# EAGLE schematic Shutter (EAGLE 8.2.2)
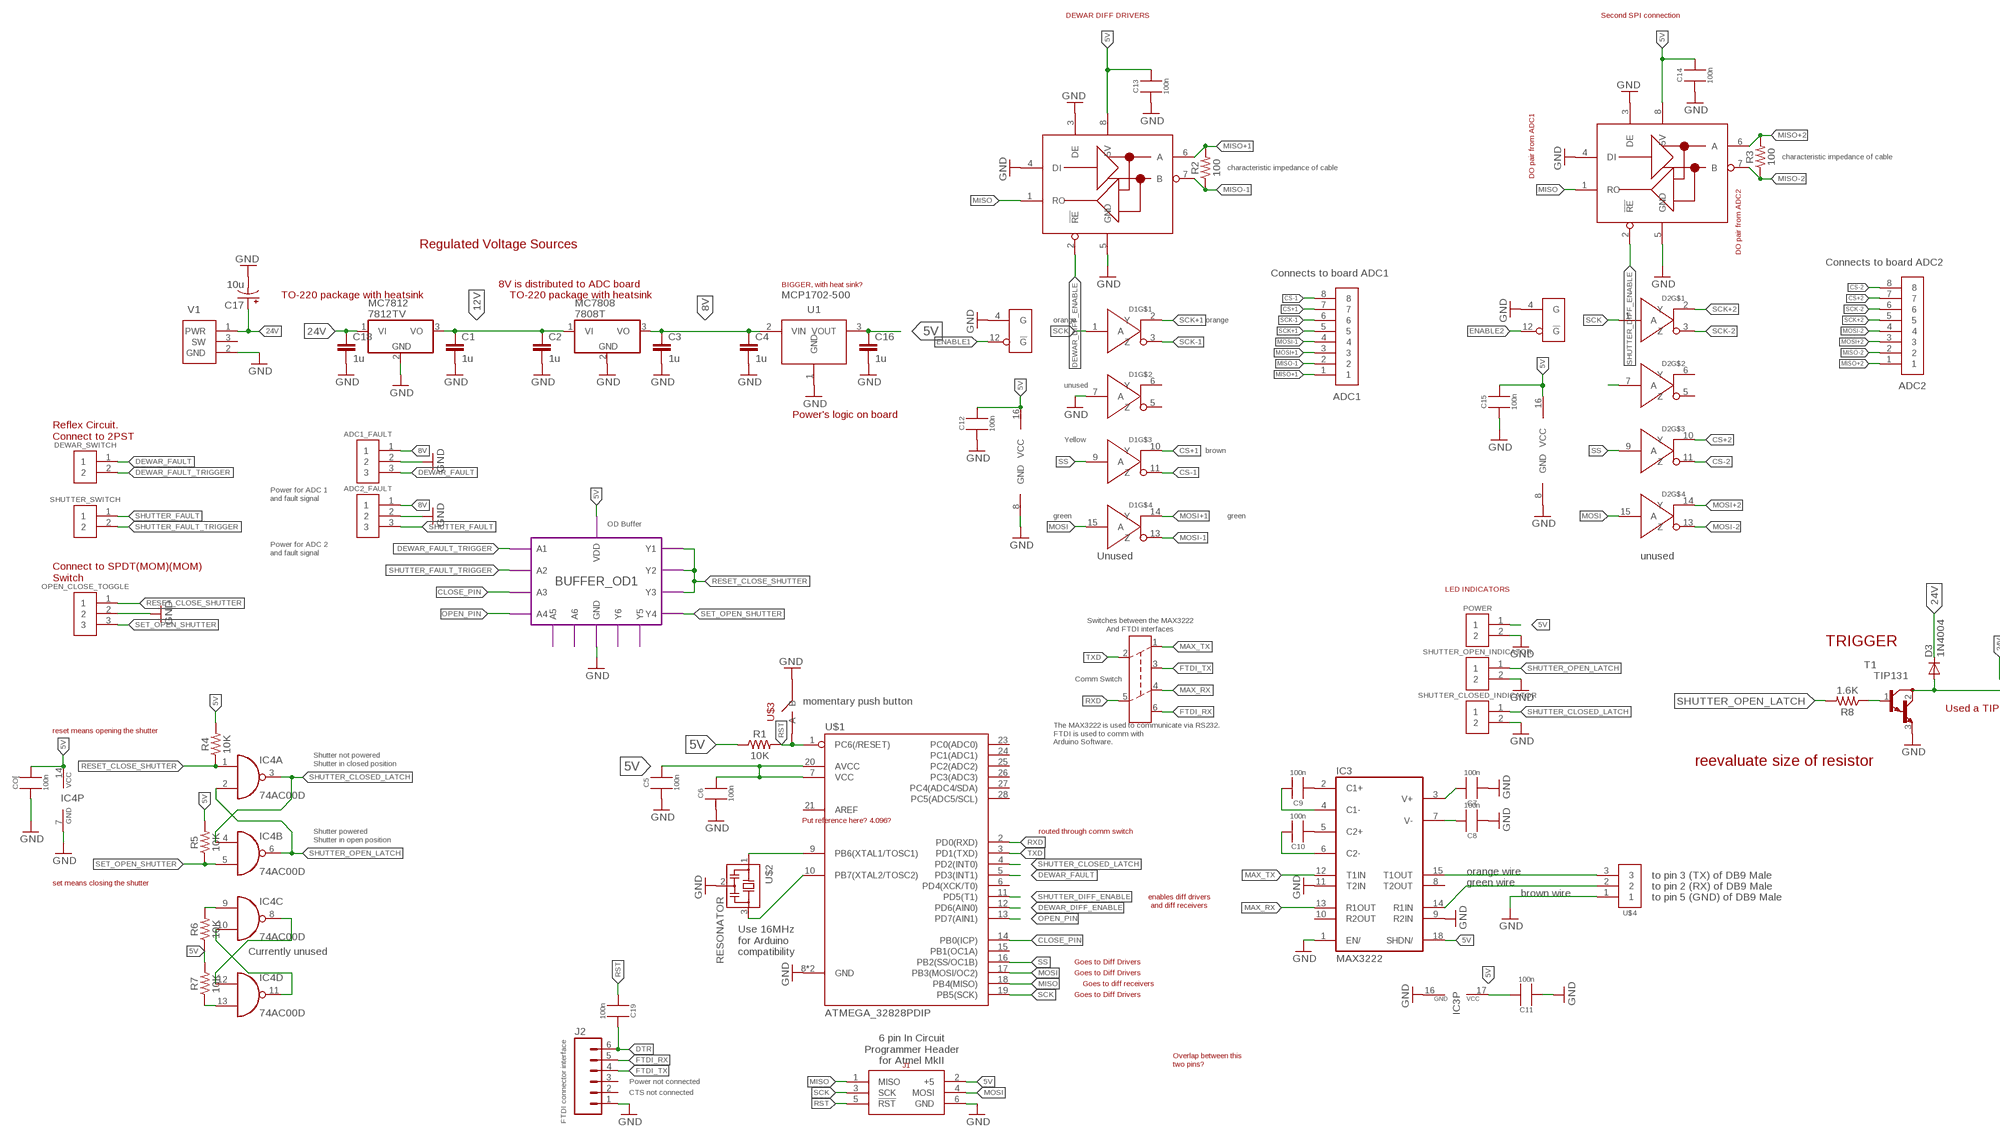
[diagram p0: schematic, sheet 1, part 1 of 2]
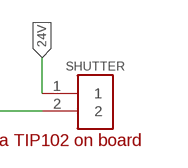
[diagram p1: schematic, sheet 1, part 2 of 2]

## Parts
ADC1  M08  [OSTVN08]
ADC1_FAULT  M03  [OSTVN03]
ADC2  M08  [OSTVN08]
ADC2_FAULT  M03  [OSTVN03]
C1  1u  CAP5MM  [CAP_CER_TDK_FK28_5MM]
C2  1u  CAP5MM  [CAP_CER_TDK_FK28_5MM]
C3  1u  CAP5MM  [CAP_CER_TDK_FK28_5MM]
C4  1u  CAP5MM  [CAP_CER_TDK_FK28_5MM]
C5  100n  CAP805B  [0805_B]
C6  100n  CAP805B  [0805_B]
C7  100n  CAP805B  [0805_B]
C8  100n  CAP805B  [0805_B]
C9  100n  CAP805B  [0805_B]
C10  100n  CAP805B  [0805_B]
C11  100n  CAP805B  [0805_B]
C12  100n  CAP805B  [0805_B]
C13  100n  CAP805B  [0805_B]
C14  100n  CAP805B  [0805_B]
C15  100n  CAP805B  [0805_B]
C16  1u  CAP5MM  [CAP_CER_TDK_FK28_5MM]
C17  10u  CAP_POL8_3.5  [CAP_POL_8_3.5]
C18  1u  CAP5MM  [CAP_CER_TDK_FK28_5MM]
C19  100n  CAP805B  [0805_B]
CO[  100n  CAP805B  [0805_B]
D1  AM26C31  [SOIC_16_NARROW]
D2  AM26C31  [SOIC_16_NARROW]
D3  1N4004  [DO41-10]
DEWAR_SWITCH  M02  [OSTVN02]
IC3  MAX3222  [DIL18]
IC4  74AC00D  [SO14]
J1  ATMEL_PROGRAMMER_HEADERTH  [ATMEL_PROGRAMMER_HEADER]
J2  M06NO_SILK_FEMALE_PTH  [1X06_NO_SILK]
MC7808  7808T  [TO220H]
MC7812  7812TV  [TO220V]
OPEN_CLOSE_TOGGLE  M03  [OSTVN03]
POWER  M02  [OSTVN02]
R1  10K  RESISTOR0805  [0805]
R2  100  RESISTOR0805  [0805]
R3  100  RESISTOR0805  [0805]
R4  10K  RESISTOR0805  [0805]
R5  10K  RESISTOR0805  [0805]
R6  10K  RESISTOR0805  [0805]
R7  10K  RESISTOR0805  [0805]
R8  1.6K  RESISTOR0805  [0805]
SHUTTER  M02  [OSTVN02]
SHUTTER_CLOSED_INDICATOR  M02  [OSTVN02]
SHUTTER_OPEN_INDICATOR  M02  [OSTVN02]
SHUTTER_SWITCH  M02  [OSTVN02]
T1  TIP131  [TO220]
U1  VOLTAGE_REGULATOR_LDOMCP1702_TO-92  [TO-92]
U$1  ATMEGA_32828PDIP  [DIP-28]
U$2  RESONATOR  [CSTCE]
U$3  TACTILE  [CB315FP]
U$4  MO3  [OSTVN03]
U$5  LTC1485DIP  [DIP-8]
U$6  LTC1485DIP  [DIP-8]
U$7  DPDTA_DP  [A_DP_STRAIGHT_BRACKET]
V1  POWER_JACK  [PJ-102AH]

## Module instances
BUFFER_OD1 = BUFFER_OD_HEX

## Nets
5V: C5.2 C6.2 C11.2 C12.2 C13.2 C14.2 C15.2 C16.P$1 CO[.2 D1.16(VCC) D2.16(VCC) IC3.17(VCC) IC3.18(SHDN/) IC4.14(P:VCC) J1.2(+5) POWER.1 R1.1 R4.2 R5.2 R6.1 R7.2 U1.3(VOUT) U$1.7(VCC) U$1.20(AVCC) U$5.8(5V) U$6.8(5V) ; port BUFFER_OD1.VDD
8V: ADC1_FAULT.1 ADC2_FAULT.1 C3.P$1 C4.P$1 MC7808.3(VO) U1.2(VIN)
12V: C1.P$1 C2.P$1 MC7808.1(VI) MC7812.3(VO)
24V: C17.+ C18.P$1 D3.C MC7812.1(VI) SHUTTER.1 V1.1(PWR)
CLOSE_PIN: U$1.14(PB0(ICP)) ; port BUFFER_OD1.A3
CS+1: ADC1.7 D1.10(Y)
CS+2: ADC2.7 D2.10(Y)
CS-1: ADC1.8 D1.11(Z)
CS-2: ADC2.8 D2.11(Z)
DEWAR_DIFF_ENABLE: U$1.12(PD6(AIN0)) U$5.2(!RE!)
DEWAR_FAULT: ADC1_FAULT.3 DEWAR_SWITCH.1 U$1.5(PD3(INT1))
DEWAR_FAULT_TRIGGER: DEWAR_SWITCH.2 ; port BUFFER_OD1.A1
DTR: C19.2 J2.6
ENABLE1: D1.12(!G!)
ENABLE2: D2.12(!G!)
FTDI_RX: J2.5 U$7.6(U1)
FTDI_TX: J2.4 U$7.3(U)
GND: ADC1_FAULT.2 ADC2_FAULT.2 C1.P$2 C2.P$2 C3.P$2 C4.P$2 C5.1 C6.1 C7.1 C8.1 C11.1 C12.1 C13.1 C14.1 C15.1 C16.P$2 C17.- C18.P$2 CO[.1 D1.4(G) D1.7(A) D1.8(GND) D2.4(G) D2.8(GND) IC3.1(EN/) IC3.9(R2IN) IC3.11(T2IN) IC3.16(GND) IC4.7(P:GND) J1.6(GND) J2.1 MC7808.2(GND) MC7812.2(GND) OPEN_CLOSE_TOGGLE.2 POWER.2 SHUTTER_CLOSED_INDICATOR.2 SHUTTER_OPEN_INDICATOR.2 T1.3(E) U1.1(GND) U$1.8(GND) U$1.22(GND) U$2.2 U$3.3(B) U$3.4(B) U$4.1 U$5.3(DE) U$5.4(DI) U$5.5(GND) U$6.3(DE) U$6.4(DI) U$6.5(GND) V1.2(GND) ; port BUFFER_OD1.GND
MAX_RX: IC3.13(R1OUT) U$7.4(D1)
MAX_TX: IC3.12(T1IN) U$7.1(D)
MISO: J1.1(MISO) U$1.18(PB4(MISO)) U$5.1(RO) U$6.1(RO)
MISO+1: ADC1.1 R2.2 U$5.6(A)
MISO+2: ADC2.1 R3.2 U$6.6(A)
MISO-1: ADC1.2 R2.1 U$5.7(B)
MISO-2: ADC2.2 R3.1 U$6.7(B)
MOSI: D1.15(A) D2.15(A) J1.4(MOSI) U$1.17(PB3(MOSI/OC2))
MOSI+1: ADC1.3 D1.14(Y)
MOSI+2: ADC2.3 D2.14(Y)
MOSI-1: ADC1.4 D1.13(Z)
MOSI-2: ADC2.4 D2.13(Z)
N$2: U$1.9(PB6(XTAL1/TOSC1)) U$2.1
N$3: U$1.10(PB7(XTAL2/TOSC2)) U$2.3
N$4: C7.2 IC3.3(V+)
N$5: C8.2 IC3.7(V-)
N$6: C9.1 IC3.2(C1+)
N$7: C10.1 IC3.5(C2+)
N$8: C9.2 IC3.4(C1-)
N$9: C10.2 IC3.6(C2-)
N$10: D3.A SHUTTER.2 T1.2(C)
N$11: D2.7(A)
N$12: IC4.9(C:I0) R6.2
N$13: IC4.13(D:I1) R7.1
N$14: IC4.10(C:I1) IC4.11(D:O)
N$15: IC4.8(C:O) IC4.12(D:I0)
N$16: R8.1 T1.1(B)
OPEN_PIN: U$1.13(PD7(AIN1)) ; port BUFFER_OD1.A4
RESET_CLOSE_SHUTTER: IC4.1(A:I0) OPEN_CLOSE_TOGGLE.1 R4.1 ; port BUFFER_OD1.Y1 BUFFER_OD1.Y2 BUFFER_OD1.Y3
RST: C19.1 J1.5(!RST!) R1.2 U$1.1(PC6(/RESET)) U$3.1(A) U$3.2(A)
RX: IC3.14(R1IN) U$4.2
RXD: U$1.2(PD0(RXD)) U$7.5(C1)
SCK: D1.1(A) D2.1(A) J1.3(SCK) U$1.19(PB5(SCK))
SCK+1: ADC1.5 D1.2(Y)
SCK+2: ADC2.5 D2.2(Y)
SCK-1: ADC1.6 D1.3(Z)
SCK-2: ADC2.6 D2.3(Z)
SET_OPEN_SHUTTER: IC4.5(B:I1) OPEN_CLOSE_TOGGLE.3 R5.1 ; port BUFFER_OD1.Y4
SHUTTER_CLOSED_LATCH: IC4.3(A:O) IC4.4(B:I0) SHUTTER_CLOSED_INDICATOR.1 U$1.4(PD2(INT0))
SHUTTER_DIFF_ENABLE: U$1.11(PD5(T1)) U$6.2(!RE!)
SHUTTER_FAULT: ADC2_FAULT.3 SHUTTER_SWITCH.1
SHUTTER_FAULT_TRIGGER: SHUTTER_SWITCH.2 ; port BUFFER_OD1.A2
SHUTTER_OPEN_LATCH: IC4.2(A:I1) IC4.6(B:O) R8.2 SHUTTER_OPEN_INDICATOR.1
SS: D1.9(A) D2.9(A) U$1.16(PB2(SS/OC1B))
TX: IC3.15(T1OUT) U$4.3
TXD: U$1.3(PD1(TXD)) U$7.2(C)
Unconnected: D1.5(Z) D1.6(Y) D2.5(Z) D2.6(Y) IC3.8(T2OUT) IC3.10(R2OUT) J2.2 J2.3 U$1.6(PD4(XCK/T0)) U$1.15(PB1(OC1A)) U$1.21(AREF) U$1.23(PC0(ADC0)) U$1.24(PC1(ADC1)) U$1.25(PC2(ADC2)) U$1.26(PC3(ADC3)) U$1.27(PC4(ADC4/SDA)) U$1.28(PC5(ADC5/SCL))

## Notes on the sheet
- DEWAR DIFF DRIVERS | Second SPI connection
- DO pair from ADC1
- characteristic impedance of cable
- characteristic impedance of cable
- DO pair from ADC2
- Regulated Voltage Sources
- Connects to board ADC2
- Connects to board ADC1
- 8V is distributed to ADC board | BIGGER, with heat sink?
- TO-220 package with heatsink | TO-220 package with heatsink | MCP1702-500
- orange | orange
- unused
- Power's logic on board
- Reflex Circuit.
  Connect to 2PST
- Yellow
- brown
- Power for ADC 1
  and fault signal
- green | green
- OD Buffer
- Power for ADC 2
  and fault signal
- Unused | unused
- Connect to SPDT(MOM)(MOM)
  Switch
- LED INDICATORS
- Switches between the MAX3222
  And FTDI interfaces
- TRIGGER
- Comm Switch
- momentary push button
- Used a TIP102 on board
- reset means opening the shutter
- The MAX3222 is used to communicate via RS232.
  FTDI is used to comm with
  Arduino Software.
- Shutter not powered
  Shutter in closed position
- reevaluate size of resistor
- Put reference here? 4.096?
- routed through comm switch
- Shutter powered
  Shutter in open position
- orange wire | to pin 3 (TX) of DB9 Male
- set means closing the shutter | green wire | to pin 2 (RX) of DB9 Male
- brown wire | to pin 5 (GND) of DB9 Male
- enables diff drivers
  and diff receivers
- Use 16MHz
  for Arduino
  compatibility
- Currently unused
- Goes to Diff Drivers
- Goes to Diff Drivers
- Goes to diff receivers
- Goes to Diff Drivers
- 6 pin In Circuit
  Programmer Header
  for Atmel MkII
- Overlap between this
  two pins?
- FTDI connector interface | Power not connected
- CTS not connected

## Power pins joined to a net without a drawn wire
SW: V1.3(SW)

## Library data of the parts
ADC1 ADC2 = OST:M08
ADC1_FAULT ADC2_FAULT OPEN_CLOSE_TOGGLE = OST:M03
C1-C4 C16 C18 = ERIC:CAP: Ceramic Capacitor
C5-C15 C19 CO[ = KEMET:CAP
C17 = ERIC:CAP_POL: Polarized Capacitor, such as Electrolytic
D1 D2 = TEXAS_INSTRUMENTS:AM26C31: Quadruple Differential Line Driver http://www.ti.com/lit/ds/symlink/am26c31.pdf
D3 = adafruit:1N4004: DIODE General purpose 1N400x type rectifier (With bigger pads) http://www.ladyada.net/library/pcb/eaglelibrary.html
DEWAR_SWITCH POWER SHUTTER SHUTTER_CLOSED_INDICATOR SHUTTER_OPEN_INDICATOR SHUTTER_SWITCH = OST:M02
IC3 = maxim:MAX3222: RS232 TRANSCEIVER; MPN: MAX3222EPN+; OC_FARNELL: 1188044; OC_NEWARK: 99K3237
IC4 = 74xx-eu:74*00: Quad 2-input NAND gate
J1 = ERIC:ATMEL_PROGRAMMER_HEADER: Board connector for Atmel MkII ISP programmer
J2 = SparkFun-Connectors:M06: Header 6 Standard 6-pin 0.1" header. Use with straight break away headers (SKU : PRT-00116), right angle break away headers (PRT-00553), swiss pins (PRT-00743), machine pins (PRT-00117), and female headers (PRT-00115). Molex polarized connector foot print use with SKU : PRT-08094 with associated crimp pins and housings. NOTES ON THE VARIANTS LOCK and LOCK_LONGPADS... This footprint was designed to help hold the alignment of a through-hole component (i.e. 6-pin header) while soldering it into place. You may notice that each hole has been shifted either up or down by 0.005 of an inch from it's more standard position (which is a perfectly straight line). This slight alteration caused the pins (the squares in the middle) to touch the edges of the holes. Because they are alternating, it causes a "brace" to hold the component in place. 0.005 has proven to be the perfect amount of "off-center" position when using our standard breakaway headers. Although looks a little odd when you look at the bare footprint, once you have a header in there, the alteration is very hard to notice. Also,if you push a header all the way into place, it is covered up entirely on the bottom side. This idea of altering the position of holes to aid alignment will be further integrated into the Sparkfun Library for other footprints. It can help hold any component with 3 or more connection pins.; PROD_ID: CONN-08437
MC7808 MC7812 = linear:78*: Positive VOLTAGE REGULATOR Source: http://cache.national.com/ds/LM/LM78L05.pdf http://www.fairchildsemi.com/ds/LM/LM7805.pdf
R1-R8 = Stackpole:RESISTOR
T1 = transistor:TIP131: NPN BIPOLAR DARLINGTON TRANSISTOR
U1 = ERIC:VOLTAGE_REGULATOR_LDO: MCP1702 3 terminal LDO Or device with same pin out
U$1 = ERIC:ATMEGA_328
U$2 = ERIC:RESONATOR
U$3 = NKK:TACTILE
U$4 = OST:MO3
U$5 U$6 = LINEAR:LTC1485
U$7 = NKK:DPDT
V1 = CUI:POWER_JACK: Standard Power Jack with Switch

## Module SR_LATCH
Ports: S(in) !R!(in)

### Library data of the parts

## Module BUFFER_OD_HEX
Ports: VDD(in) GND(in) A1(in) A2(in) A3(in) A4(in) Y1(in) Y2(in) Y3(in) Y4(in) Y5(in) Y6(in) A6(in) A5(in)
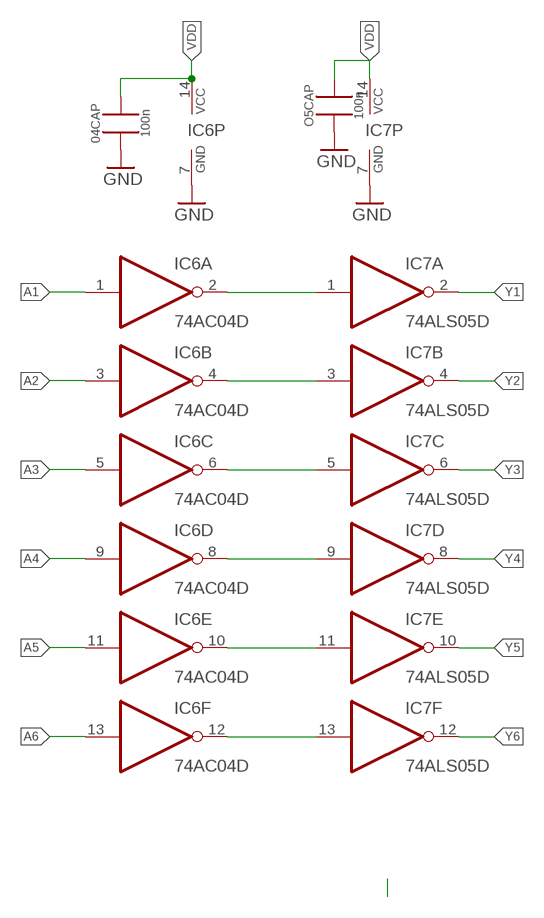
[diagram p2: schematic, module BUFFER_OD_HEX, sheet 1]

### Parts
04CAP  100n  CAP805B  [0805_B]
IC6  74AC04D  [SO14]
IC7  74ALS05D  [SO14]
O5CAP  100n  CAP805B  [0805_B]

### Nets
A1: IC6.1(A:I)
A2: IC6.3(B:I)
A3: IC6.5(C:I)
A4: IC6.9(D:I)
A5: IC6.11(E:I)
A6: IC6.13(F:I)
GND: 04CAP.1 IC6.7(P:GND) IC7.7(P:GND) O5CAP.1
N$1: IC6.2(A:O) IC7.1(A:I)
N$2: IC6.10(E:O) IC7.11(E:I)
N$3: IC6.12(F:O) IC7.13(F:I)
N$36: IC6.4(B:O) IC7.3(B:I)
N$37: IC6.6(C:O) IC7.5(C:I)
N$38: IC6.8(D:O) IC7.9(D:I)
VDD: 04CAP.2 IC6.14(P:VCC) IC7.14(P:VCC) O5CAP.2
Y1: IC7.2(A:O)
Y2: IC7.4(B:O)
Y3: IC7.6(C:O)
Y4: IC7.8(D:O)
Y5: IC7.10(E:O)
Y6: IC7.12(F:O)

### Library data of the parts
04CAP O5CAP = KEMET:CAP
IC6 = 74xx-eu:74*04: Hex INVERTER
IC7 = 74xx-eu:74*05: Hex INVERTER, open collector

## Module VOLTAGE_REGULATION
Ports: 

### Library data of the parts